# EAGLE design alien2 (EAGLE 5.10)
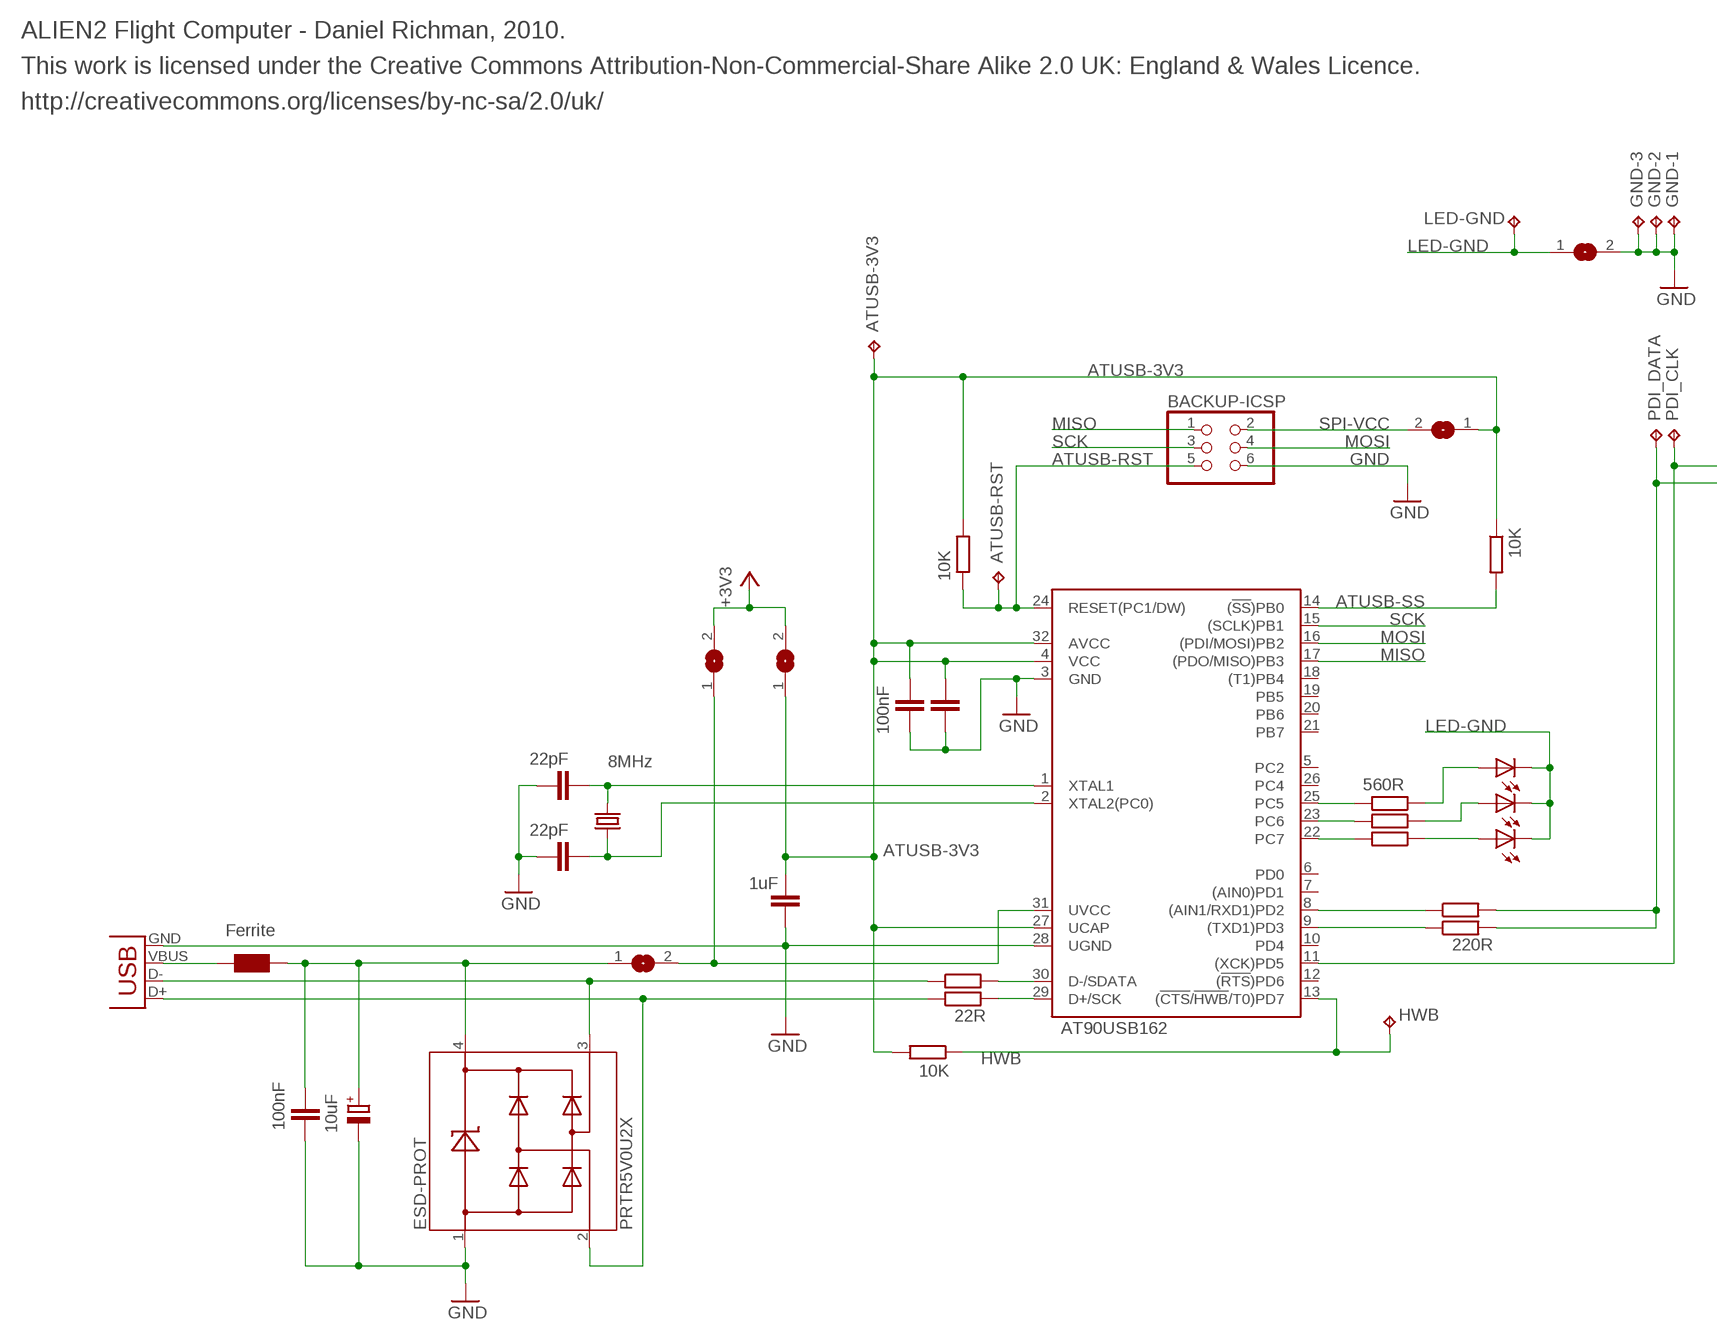
[diagram p0: schematic, sheet 1, part 1 of 2]
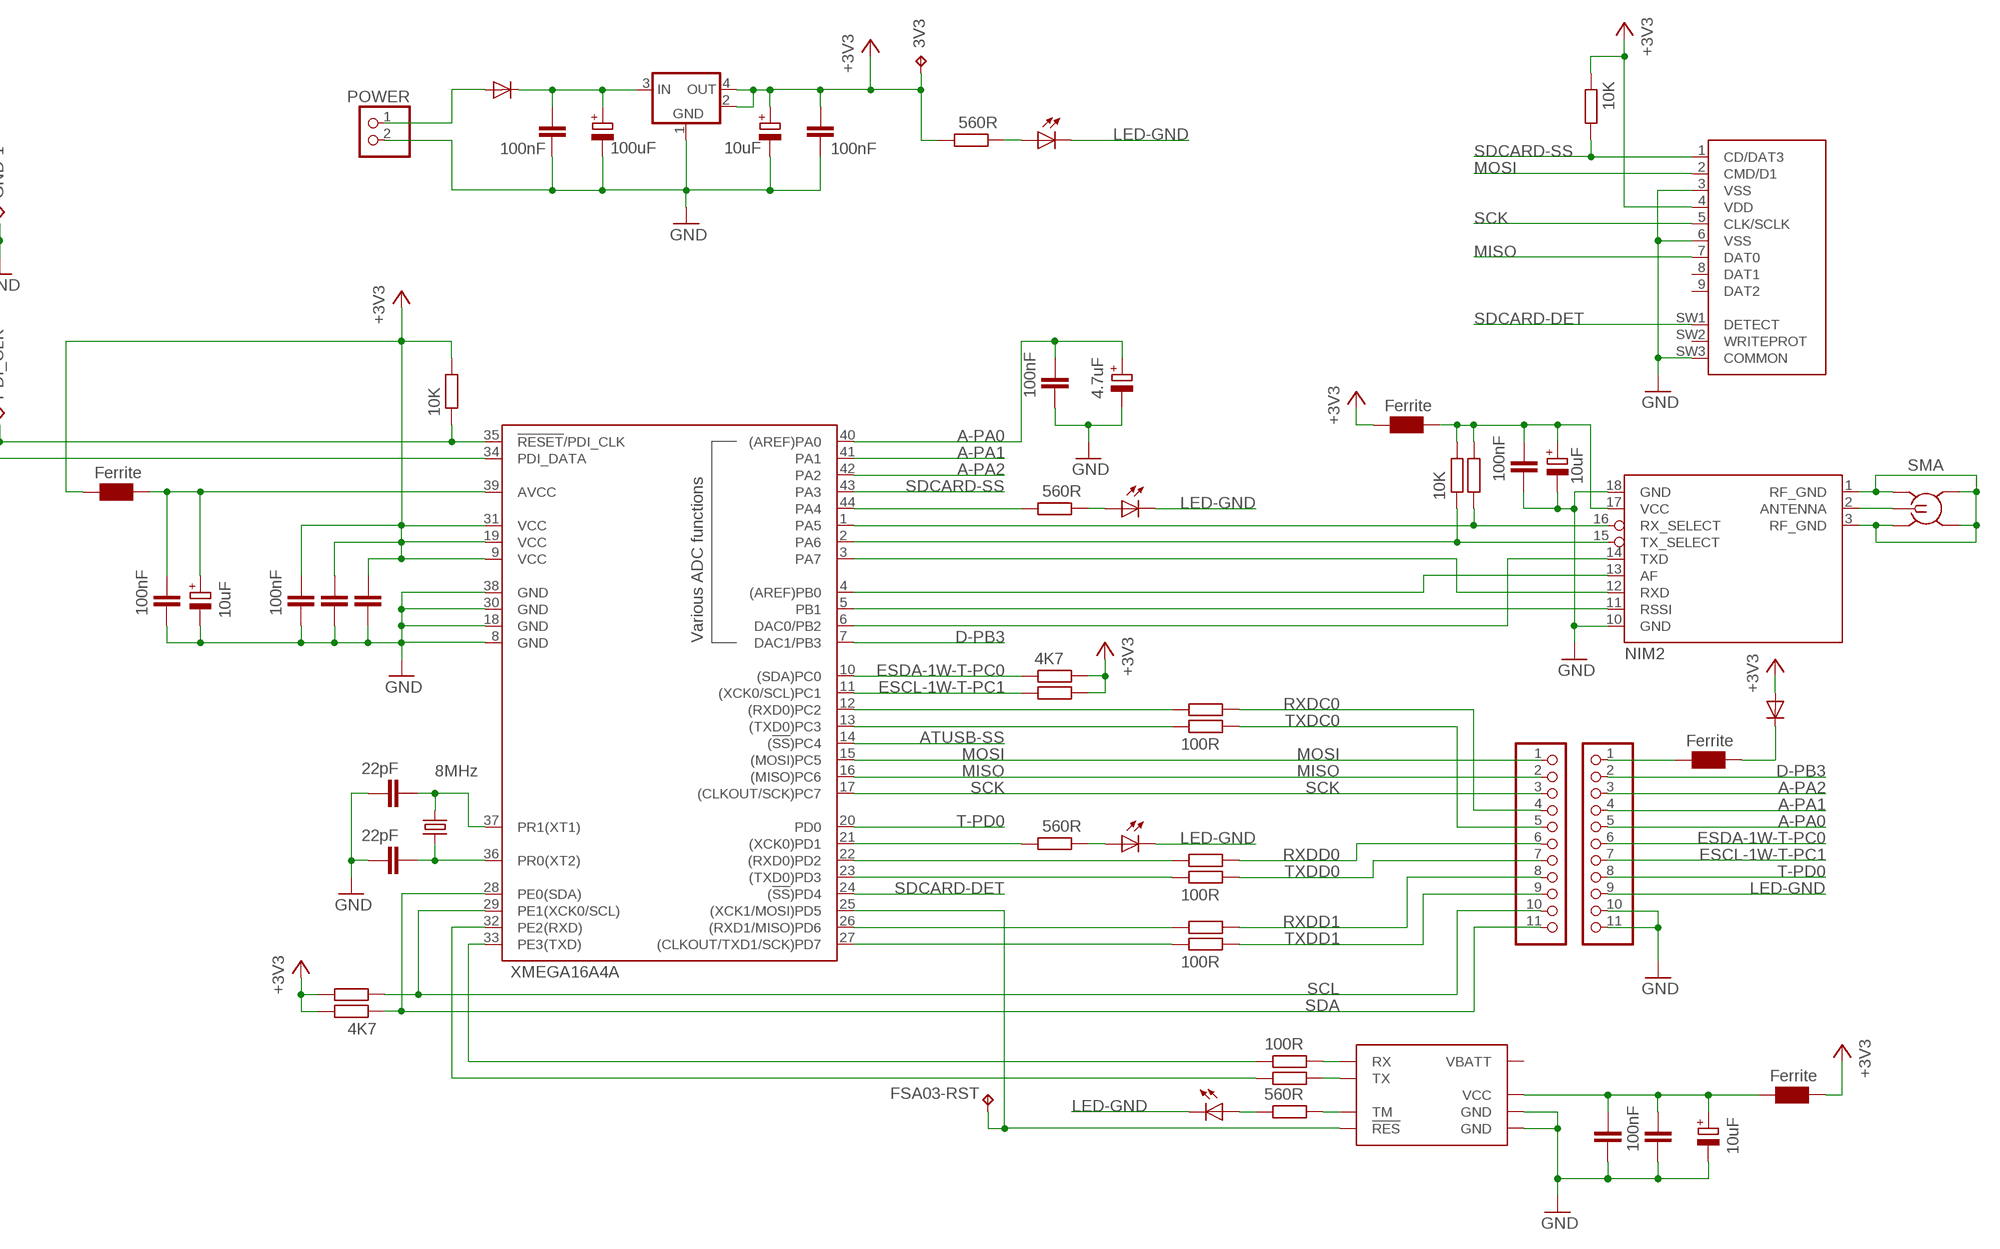
[diagram p1: schematic, sheet 1, part 2 of 2]

## Parts
3V3  TPTP10R  [TP10R]
ATUSB-3V3  TPTP10R  [TP10R]
ATUSB-RST  TPTP10R  [TP10R]
BACKUP-ICSP  PINHD-2X3  [ISP6]
BREAKOUT-1  PINHD-1X11  [1X11]
BREAKOUT-2  PINHD-1X11  [1X11]
BSPI-POWER  SJ  [SJ]
C1-UCAP  1uF  C-EUC0603  [C0603]
C2  22pF  C-EUC0603  [C0603]
C3  22pF  C-EUC0603  [C0603]
C4  22pF  C-EUC0603  [C0603]
C5  22pF  C-EUC0603  [C0603]
C10-FSA03-1  100nF  C-EUC0603  [C0603]
C10-FSA03-2  100nF  C-EUC0603  [C0603]
C10-NIM2  100nF  C-EUC0603  [C0603]
C10-VBUS  100nF  C-EUC0603  [C0603]
C10-XM  100nF  C-EUC0603  [C0603]
C10-XM-AVCC  100nF  C-EUC0603  [C0603]
C11-XM  100nF  C-EUC0603  [C0603]
C12-XM  100nF  C-EUC0603  [C0603]
C20-AREF  4.7uF  CPOL-EU153CLV-0405  [153CLV-0405]
C20-REGOUT  10uF  CPOL-EU153CLV-0405  [153CLV-0405]
C21-ATUSB  100nF  C-EUC0603  [C0603]
C21-VIN  100nF  C-EUC0603  [C0603]
C22-AREF  100nF  C-EUC0603  [C0603]
C22-REGOUT  100nF  C-EUC0603  [C0603]
C39-FSA03  10uF  CPOL-EU153CLV-0405  [153CLV-0405]
C39-NIM2  10uF  CPOL-EU153CLV-0405  [153CLV-0405]
C39-VBUS  10uF  CPOL-EU153CLV-0405  [153CLV-0405]
C39-VIN  100uF  CPOL-EU153CLV-0405  [153CLV-0405]
C39-XM-AVCC  10uF  CPOL-EU153CLV-0405  [153CLV-0405]
C40-ATUSB  100nF  C-EUC0603  [C0603]
D1  SHOTTKY  DIODE  [SMB]
D2  SHOTTKY  DIODE  [SMB]
ENABLE-VBUS  SJ  [SJ]
ESD-PROT  PRTR5V0U2X  [SOT143]
FB-BREAKOUT  Ferrite  WE-CBF_0603  [0603]
FB-FSA03  Ferrite  WE-CBF_0603  [0603]
FB-NIM2  Ferrite  WE-CBF_0603  [0603]
FB-USB  Ferrite  WE-CBF_0603  [0603]
FB-XM-AVCC  Ferrite  WE-CBF_0603  [0603]
FSA03  FSA03NOANT  [FSA03-NOANT]
FSA03-RST  TPTP10R  [TP10R]
GND-1  TPTP10R  [TP10R]
GND-2  TPTP10R  [TP10R]
GND-3  TPTP10R  [TP10R]
HWB  TPTP10R  [TP10R]
IC1  XMEGA16A4A  [TQFP44]
IC3  TC2117-3.3V  [SOT223]
LED1  LEDCHIP-LED0805  [CHIP-LED0805]
LED2  LEDCHIP-LED0805  [CHIP-LED0805]
LED3  LEDCHIP-LED0805  [CHIP-LED0805]
LED4  LEDCHIP-LED0805  [CHIP-LED0805]
LED5  LEDCHIP-LED0805  [CHIP-LED0805]
LED6  LEDCHIP-LED0805  [CHIP-LED0805]
LED7  LEDCHIP-LED0805  [CHIP-LED0805]
LED-GND  TPTP10R  [TP10R]
PDI_CLK  TPTP10R  [TP10R]
PDI_DATA  TPTP10R  [TP10R]
POWER  Farnell 1386722  PINHD-1X2  [1X02]
Q1-ATUSB  8MHz  CRYSTALHC49UP  [HC49UP]
Q2-XM  8MHz  CRYSTALHC49UP  [HC49UP]
R1-HWB  10K  R-EU_R0603  [R0603]
R2-ATUSB-RST  10K  R-EU_R0603  [R0603]
R3-USB  22R  R-EU_R0603  [R0603]
R4-USB  22R  R-EU_R0603  [R0603]
R5-PDI  220R  R-EU_R0603  [R0603]
R6-PDI  220R  R-EU_R0603  [R0603]
R7-XM-RST  10K  R-EU_R0603  [R0603]
R8  560R  R-EU_R0603  [R0603]
R9  10K  R-EU_R0603  [R0603]
R10-ATUSB-LED  560R  R-EU_R0603  [R0603]
R11  10K  R-EU_R0603  [R0603]
R12  560R  R-EU_R0603  [R0603]
R13  100R  R-EU_R0603  [R0603]
R14  100R  R-EU_R0603  [R0603]
R15-SDA  4K7  R-EU_R0603  [R0603]
R16-SCL  4K7  R-EU_R0603  [R0603]
R17-ESCL  4K7  R-EU_R0603  [R0603]
R18-ESDA  4K7  R-EU_R0603  [R0603]
R19-ATUSB-LED  560R  R-EU_R0603  [R0603]
R20-ATUSB-LED  560R  R-EU_R0603  [R0603]
R21  560R  R-EU_R0603  [R0603]
R22  100R  R-EU_R0603  [R0603]
R23  100R  R-EU_R0603  [R0603]
R24  100R  R-EU_R0603  [R0603]
R25  100R  R-EU_R0603  [R0603]
R26  100R  R-EU_R0603  [R0603]
R27  100R  R-EU_R0603  [R0603]
R28-SDCARD-SS  10K  R-EU_R0603  [R0603]
R29-ATUSB-SS  10K  R-EU_R0603  [R0603]
R30  560R  R-EU_R0603  [R0603]
SJ2  SJ  [SJ]
U$1  AT90USB162  [VQFP32]
U$2  NIM2  [NIM2]
UCAP-3V3  SJ  [SJ]
UVCC-3V3  SJ  [SJ]
X1  USBSMD  [USB-MINIB]
X2  SMA  [SMA-V]
X3  SD-CARD-HOLDER  SDBMF9186174  [SDBMF-009XXBXX2]

## Nets
+3V3: 3V3.TP C10-XM.1 C11-XM.1 C12-XM.1 C20-REGOUT.+ C22-REGOUT.1 D2.A FB-FSA03.1 FB-NIM2.2 FB-XM-AVCC.2 IC1.9(VCC) IC1.19(VCC) IC1.31(VCC) IC3.2(OUT) IC3.4(OUT) R7-XM-RST.2 R15-SDA.2 R16-SCL.2 R17-ESCL.2 R18-ESDA.2 R28-SDCARD-SS.1 R30.2 UCAP-3V3.2 UVCC-3V3.2 X3.4(VDD)
A-PA0: BREAKOUT-2.5 C20-AREF.+ C22-AREF.1 IC1.40((AREF)PA0)
A-PA1: BREAKOUT-2.4 IC1.41(PA1)
A-PA2: BREAKOUT-2.3 IC1.42(PA2)
ATUSB-3V3: ATUSB-3V3.TP BSPI-POWER.1 C1-UCAP.1 C21-ATUSB.1 C40-ATUSB.1 R1-HWB.2 R2-ATUSB-RST.2 R29-ATUSB-SS.1 U$1.4(VCC) U$1.27(UCAP) U$1.32(AVCC) UCAP-3V3.1
ATUSB-RST: ATUSB-RST.TP BACKUP-ICSP.5 R2-ATUSB-RST.1 U$1.24(RESET(PC1/DW))
ATUSB-SS: IC1.14((!SS!)PC4) R29-ATUSB-SS.2 U$1.14((!SS!)PB0)
D-PB3: BREAKOUT-2.2 IC1.7(DAC1/PB3)
ESCL-1W-T-PC1: BREAKOUT-2.7 IC1.11((XCK0/SCL)PC1) R17-ESCL.1
ESDA-1W-T-PC0: BREAKOUT-2.6 IC1.10((SDA)PC0) R18-ESDA.1
FSA03-RST: FSA03-RST.TP FSA03.RES(!RES!) IC1.25((XCK1/MOSI)PD5)
GND: BACKUP-ICSP.6 BREAKOUT-2.10 BREAKOUT-2.11 C1-UCAP.2 C2.2 C3.2 C4.2 C5.2 C10-FSA03-1.2 C10-FSA03-2.2 C10-NIM2.2 C10-VBUS.2 C10-XM-AVCC.2 C10-XM.2 C11-XM.2 C12-XM.2 C20-AREF.- C20-REGOUT.- C21-ATUSB.2 C21-VIN.2 C22-AREF.2 C22-REGOUT.2 C39-FSA03.- C39-NIM2.- C39-VBUS.- C39-VIN.- C39-XM-AVCC.- C40-ATUSB.2 ESD-PROT.1 FSA03.GND1(GND) FSA03.GND2(GND) GND-1.TP GND-2.TP GND-3.TP IC1.8(GND) IC1.18(GND) IC1.30(GND) IC1.38(GND) IC3.1(GND) POWER.2 SJ2.2 U$1.3(GND) U$1.28(UGND) U$2.10(GND) U$2.18(GND) X1.GND X3.3(VSS) X3.6(VSS) X3.SW3(COMMON)
HWB: HWB.TP R1-HWB.1 U$1.13((!CTS!/!HWB!/T0)PD7)
LED-GND: BREAKOUT-2.9 LED1.C LED2.C LED3.C LED4.C LED5.C LED6.C LED7.C LED-GND.TP SJ2.1
MISO: BACKUP-ICSP.1 BREAKOUT-1.2 IC1.16((MISO)PC6) U$1.17((PDO/MISO)PB3) X3.7(DAT0)
MOSI: BACKUP-ICSP.4 BREAKOUT-1.1 IC1.15((MOSI)PC5) U$1.16((PDI/MOSI)PB2) X3.2(CMD/D1)
N$1: R10-ATUSB-LED.2 U$1.22(PC7)
N$2: C10-VBUS.1 C39-VBUS.+ ENABLE-VBUS.1 ESD-PROT.4 FB-USB.1
N$3: R3-USB.2 U$1.30(D-/SDATA)
N$4: R4-USB.2 U$1.29(D+/SCK)
N$5: C3.1 Q1-ATUSB.2 U$1.1(XTAL1)
N$6: C2.1 Q1-ATUSB.1 U$1.2(XTAL2(PC0))
N$7: C21-VIN.1 C39-VIN.+ D1.C IC3.3(IN)
N$8: U$2.2(ANTENNA) X2.1(CENTRE)
N$9: ESD-PROT.3 R3-USB.1 X1.D-
N$10: ESD-PROT.2 R4-USB.1 X1.D+
N$11: LED1.A R10-ATUSB-LED.1
N$12: IC1.34(PDI_DATA) PDI_DATA.TP R5-PDI.2 R6-PDI.2
N$13: R5-PDI.1 U$1.8((AIN1/RXD1)PD2)
N$14: R6-PDI.1 U$1.9((TXD1)PD3)
N$17: C5.1 IC1.37(PR1(XT1)) Q2-XM.2
N$18: C4.1 IC1.36(PR0(XT2)) Q2-XM.1
N$19: LED4.A R8.1
N$20: IC1.3(PA7) U$2.12(RXD)
N$21: BREAKOUT-2.1 FB-BREAKOUT.2
N$22: IC1.32(PE2(RXD)) R14.1
N$23: IC1.33(PE3(TXD)) R13.1
N$24: IC1.1(PA5) R11.1 U$2.16(RX_SELECT)
N$25: IC1.2(PA6) R9.1 U$2.15(TX_SELECT)
N$26: IC1.6(DAC0/PB2) U$2.14(TXD)
N$27: IC1.4((AREF)PB0) U$2.13(AF)
N$28: IC1.5(PB1) U$2.11(RSSI)
N$29: FSA03.RX R13.2
N$30: LED2.A R12.1
N$31: IC1.35(!RESET!/PDI_CLK) PDI_CLK.TP R7-XM-RST.1 U$1.11((XCK)PD5)
N$32: FSA03.TM R12.2
N$33: LED6.A R21.1
N$34: D2.C FB-BREAKOUT.1
N$35: IC1.44(PA4) R8.2
N$36: FSA03.TX R14.2
N$37: R19-ATUSB-LED.2 U$1.23(PC6)
N$38: LED3.A R19-ATUSB-LED.1
N$39: R20-ATUSB-LED.2 U$1.25(PC5)
N$40: LED5.A R20-ATUSB-LED.1
N$41: IC1.21((XCK0)PD1) R21.2
N$42: IC1.12((RXD0)PC2) R22.1
N$43: IC1.13((TXD0)PC3) R23.1
N$44: IC1.22((RXD0)PD2) R24.1
N$45: IC1.23((TXD0)PD3) R25.1
N$46: IC1.26((RXD1/MISO)PD6) R26.1
N$47: IC1.27((CLKOUT/TXD1/SCK)PD7) R27.1
N$48: FB-USB.2 X1.VBUS
N$49: C10-NIM2.1 C39-NIM2.+ FB-NIM2.1 R9.2 R11.2 U$2.17(VCC)
N$50: C10-FSA03-1.1 C10-FSA03-2.1 C39-FSA03.+ FB-FSA03.2 FSA03.VCC
N$51: C10-XM-AVCC.1 C39-XM-AVCC.+ FB-XM-AVCC.1 IC1.39(AVCC)
N$52: LED7.A R30.1
N$53: D1.A POWER.1
N$56: ENABLE-VBUS.2 U$1.31(UVCC) UVCC-3V3.1
RF_GND: U$2.1(RF_GND) U$2.3(RF_GND) X2.2(GND1) X2.3(GND2) X2.4(GND3) X2.5(GND4)
RXDC0: BREAKOUT-1.4 R22.2
RXDD0: BREAKOUT-1.6 R24.2
RXDD1: BREAKOUT-1.8 R26.2
SCK: BACKUP-ICSP.3 BREAKOUT-1.3 IC1.17((CLKOUT/SCK)PC7) U$1.15((SCLK)PB1) X3.5(CLK/SCLK)
SCL: BREAKOUT-1.10 IC1.29(PE1(XCK0/SCL)) R16-SCL.1
SDA: BREAKOUT-1.11 IC1.28(PE0(SDA)) R15-SDA.1
SDCARD-DET: IC1.24((!SS!)PD4) X3.SW1(DETECT)
SDCARD-SS: IC1.43(PA3) R28-SDCARD-SS.2 X3.1(CD/DAT3)
SPI-VCC: BACKUP-ICSP.2 BSPI-POWER.2
T-PD0: BREAKOUT-2.8 IC1.20(PD0)
TXDC0: BREAKOUT-1.5 R23.2
TXDD0: BREAKOUT-1.7 R25.2
TXDD1: BREAKOUT-1.9 R27.2
Unconnected: FSA03.NC1(NC) FSA03.NC2(NC) FSA03.NC3(NC) FSA03.NC4(NC) FSA03.NC5(NC) U$1.5(PC2) U$1.6(PD0) U$1.7((AIN0)PD1) U$1.10(PD4) U$1.12((!RTS!)PD6) U$1.18((T1)PB4) U$1.19(PB5) U$1.20(PB6) U$1.21(PB7) U$1.26(PC4) X3.8(DAT1) X3.9(DAT2) X3.SW2(WRITEPROT)

## Notes on the sheet
- ALIEN2 Flight Computer - Daniel Richman, 2010.
- This work is licensed under the Creative Commons Attribution-Non-Commercial-Share Alike 2.0 UK: England & Wales Licence.
- http://creativecommons.org/licenses/by-nc-sa/2.0/uk/

## Power pins joined to a net without a drawn wire
VBATT: FSA03.VBATT

## Library data of the parts
3V3 ATUSB-3V3 ATUSB-RST FSA03-RST GND-1-GND-3 HWB LED-GND PDI_CLK PDI_DATA = testpad:TP: Test pad
BACKUP-ICSP = daniel-misc:PINHD-2X3: PIN HEADER
BREAKOUT-1 BREAKOUT-2 = pinhead:PINHD-1X11: PIN HEADER
BSPI-POWER ENABLE-VBUS SJ2 UCAP-3V3 UVCC-3V3 = jumper:SJ: SMD solder JUMPER
C1-UCAP C2-C5 C10-FSA03-1 C10-FSA03-2 C10-NIM2 C10-VBUS C10-XM C10-XM-AVCC C11-XM C12-XM C21-ATUSB C21-VIN C22-AREF C22-REGOUT C40-ATUSB = resistor:C-EU: CAPACITOR, European symbol
C20-AREF C20-REGOUT C39-FSA03 C39-NIM2 C39-VBUS C39-VIN C39-XM-AVCC = resistor:CPOL-EU: POLARIZED CAPACITOR, European symbol
D1 D2 = daniel-misc:DIODE
ESD-PROT = daniel-misc:PRTR5V0U2X
FB-BREAKOUT FB-FSA03 FB-NIM2 FB-USB FB-XM-AVCC = wuerth-elektronik:WE-CBF: SMD EMI Suppression Ferrite Beads - excellent anti-EMI properties - low DCR - impedances till 3000 ohms - rated current up to 6 A
FSA03 = FSA03:FSA03: Falcom FSA03 surface mount GPS with ublox chipset, part created by Landon Cox, ESawdust.com
IC1 = avr2:XMEGA16A4: MICROCONTROLLER Features High-performance, Low-power 8/16-bit AVR XMEGA Microcontroller Non-Volatile Program and Data Memories - 16 KB - 128 KB of In-System Self-Programmable Flash - 4 KB - 8 KB Boot Code Section with Independent Lock Bits - 1 KB - 2 KB EEPROM - 2 KB - 8 KB Internal SRAM Peripheral Features - Four-channel DMA Controller with support for external requests - Eight-channel Event System - Five 16-bit Timer/Counters Three Timer/Counters with 4 Output Compare or Input Capture channels Two Timer/Counters with 2 Output Compare or Input Capture channels High-Resolution Extensions on all Timer/Counters Advanced Waveform Extension on one Timer/Counter - Five USARTs IrDA Extension on one USART - Two Two-Wire Interfaces with dual address match (I2C and SMBus compatible) - Two SPIs (Serial Peripheral Interfaces) peripherals - AES and DES Crypto Engine - 16-bit Real Time Counter with Separate Oscillator - One Twelve-channel, 12-bit, 2 Msps Analog to Digital Converter - One Two-channel, 12-bit, 1 Msps Digital to Analog Converter - Two Analog Comparators with Window compare function - External Interrupts on all General Purpose I/O pins - Programmable Watchdog Timer with Separate On-chip Ultra Low Power Oscillator Special Microcontroller Features - Power-on Reset and Programmable Brown-out Detection - Internal and External Clock Options with PLL - Programmable Multi-level Interrupt Controller - Sleep Modes: Idle, Power-down, Standby, Power-save, Extended Standby - Advanced Programming, Test and Debugging Interfaces PDI (Program and Debug Interface) for programming, test and debugging I/O and Packages - 34 Programmable I/O Lines - 44 - lead TQFP - 44 - pad VQFN/QFN - 49 - ball VFBGA Operating Voltage - 1.6 - 3.6V Speed performance - 0 - 12 MHz @ 1.6 - 3.6V - 0 - 32 MHz @ 2.7 - 3.6V Drawn by Dipl.-Ing. (FH) Robert Siegler Created: 27.05.09
IC3 = daniel-misc:TC2117-3.3V: MICROCHIP - TC2117-3.3VDBTR - CMSO LDO, 3.3V, 800MA, SOT223-3 Source: http://uk.farnell.com/microchip/tc2117-3-3vdbtr/cmso-ldo-3-3v-800ma-sot223-3/dp/1605581 Manufacturer: MICROCHIP Farnell Order Code: 1605581 Manufacturer Part No: TC2117-3.3VDBTR RoHS: Yes Description: CMSO LDO, 3.3V, 800MA, SOT223-3 Output Voltage: 3.3V Dropout voltage: 0.45V No. of Pins: 3 Voltage Regulator IC Case Style: SOT-223 Operating Temperature Range: -40°C to +125°C Case Style: SOT-223 Max Operating Temperature: 125°C Min Temperature Operating: -40°C Base Number: 2117 Max Input Voltage: 6V Max Output Current: 0.8A Max Output Voltage: 3.3V Max Supply Voltage: 6V Min Input Voltage: 2.7V Min Supply Voltage: 2.7V No. of Outputs: 1 Percentage Accuracy: 0.5% Termination Type: SMD Voltage Regulator Type: Fixed
LED1-LED7 = led:LED: LED OSRAM: - CHIPLED LG R971, LG N971, LY N971, LG Q971, LY Q971, LO R971, LY R971 LH N974, LH R974 LS Q976, LO Q976, LY Q976 LO Q996 - Hyper CHIPLED LW Q18S LB Q993, LB Q99A, LB R99A - SideLED LS A670, LO A670, LY A670, LG A670, LP A670 LB A673, LV A673, LT A673, LW A673 LH A674 LY A675 LS A676, LA A676, LO A676, LY A676, LW A676 LS A679, LY A679, LG A679 - Hyper Micro SIDELED® LS Y876, LA Y876, LO Y876, LY Y876 LT Y87S - SmartLED LW L88C, LW L88S LB L89C, LB L89S, LG L890 LS L89K, LO L89K, LY L89K LS L896, LA L896, LO L896, LY L896 - TOPLED LS T670, LO T670, LY T670, LG T670, LP T670 LSG T670, LSP T670, LSY T670, LOP T670, LYG T670 LG T671, LOG T671, LSG T671 LB T673, LV T673, LT T673, LW T673 LH T674 LS T676, LA T676, LO T676, LY T676, LB T676, LH T676, LSB T676, LW T676 LB T67C, LV T67C, LT T67C, LS T67K, LO T67K, LY T67K, LW E67C LS E67B, LA E67B, LO E67B, LY E67B, LB E67C, LV E67C, LT E67C LW T67C LS T679, LY T679, LG T679 LS T770, LO T770, LY T770, LG T770, LP T770 LB T773, LV T773, LT T773, LW T773 LH T774 LS E675, LA E675, LY E675, LS T675 LS T776, LA T776, LO T776, LY T776, LB T776 LHGB T686 LT T68C, LB T68C - Hyper Mini TOPLED® LB M676 - Mini TOPLED Santana® LG M470 LS M47K, LO M47K, LY M47K Source: http://www.osram.convergy.de LUXEON: - LUMILED® LXK2-PW12-R00, LXK2-PW12-S00, LXK2-PW14-U00, LXK2-PW14-V00 LXK2-PM12-R00, LXK2-PM12-S00, LXK2-PM14-U00 LXK2-PE12-Q00, LXK2-PE12-R00, LXK2-PE12-S00, LXK2-PE14-T00, LXK2-PE14-U00 LXK2-PB12-K00, LXK2-PB12-L00, LXK2-PB12-M00, LXK2-PB14-N00, LXK2-PB14-P00, LXK2-PB14-Q00 LXK2-PR12-L00, LXK2-PR12-M00, LXK2-PR14-Q00, LXK2-PR14-R00 LXK2-PD12-Q00, LXK2-PD12-R00, LXK2-PD12-S00 LXK2-PH12-R00, LXK2-PH12-S00 LXK2-PL12-P00, LXK2-PL12-Q00, LXK2-PL12-R00 Source: www.luxeon.com KINGBRIGHT: KA-3528ASYC Source: www.kingbright.com
POWER = pinhead:PINHD-1X2: PIN HEADER
Q1-ATUSB Q2-XM = crystal:CRYSTAL: CRYSTAL
R1-HWB R2-ATUSB-RST R3-USB R4-USB R5-PDI R6-PDI R7-XM-RST R8 R9 R10-ATUSB-LED R11-R14 R15-SDA R16-SCL R17-ESCL R18-ESDA R19-ATUSB-LED R20-ATUSB-LED R21-R27 R28-SDCARD-SS R29-ATUSB-SS R30 = resistor:R-EU_: RESISTOR, European symbol
U$1 = avr2:AT90USB162
U$2 = radiometrix:NIM2
X1 = SparkFun:USB: USB Connectors USB-B-PTH is fully proven SKU : PRT-00139 USB-miniB is fully proven SKU : PRT-00587 USB-A-PCB is untested. USB-A-H is throughly reviewed, but untested. Spark Fun Electronics SKU : PRT-00437 USB-B-SMT is throughly reviewed, but untested. Needs silkscreen touching up. USB-A-S has not been used/tested USB-MB-H has not been used/tested
X2 = daniel-misc:SMA: FEMALE SMA CONNECTOR Radiall distributor RS 112-3794
X3 = daniel-misc:SDBMF: SD MEMORY CARD PUSH-PUSH WITH CONNECTOR TYPE B (BIG SWUÌTCH #3) KINGFONT PRECISION INDUSTIAL CO., LTD Source: http://www.farnell.com/datasheets/74273.pdf Best.-Nr.: 9186174 Hersteller: MULTICOMP Herstellerbez.: SDBMF-00915B0T2

## Net classes
3 usbvcc: width 0.508 mm, drill 0.508 mm, clearance 0.152 mm

## Board
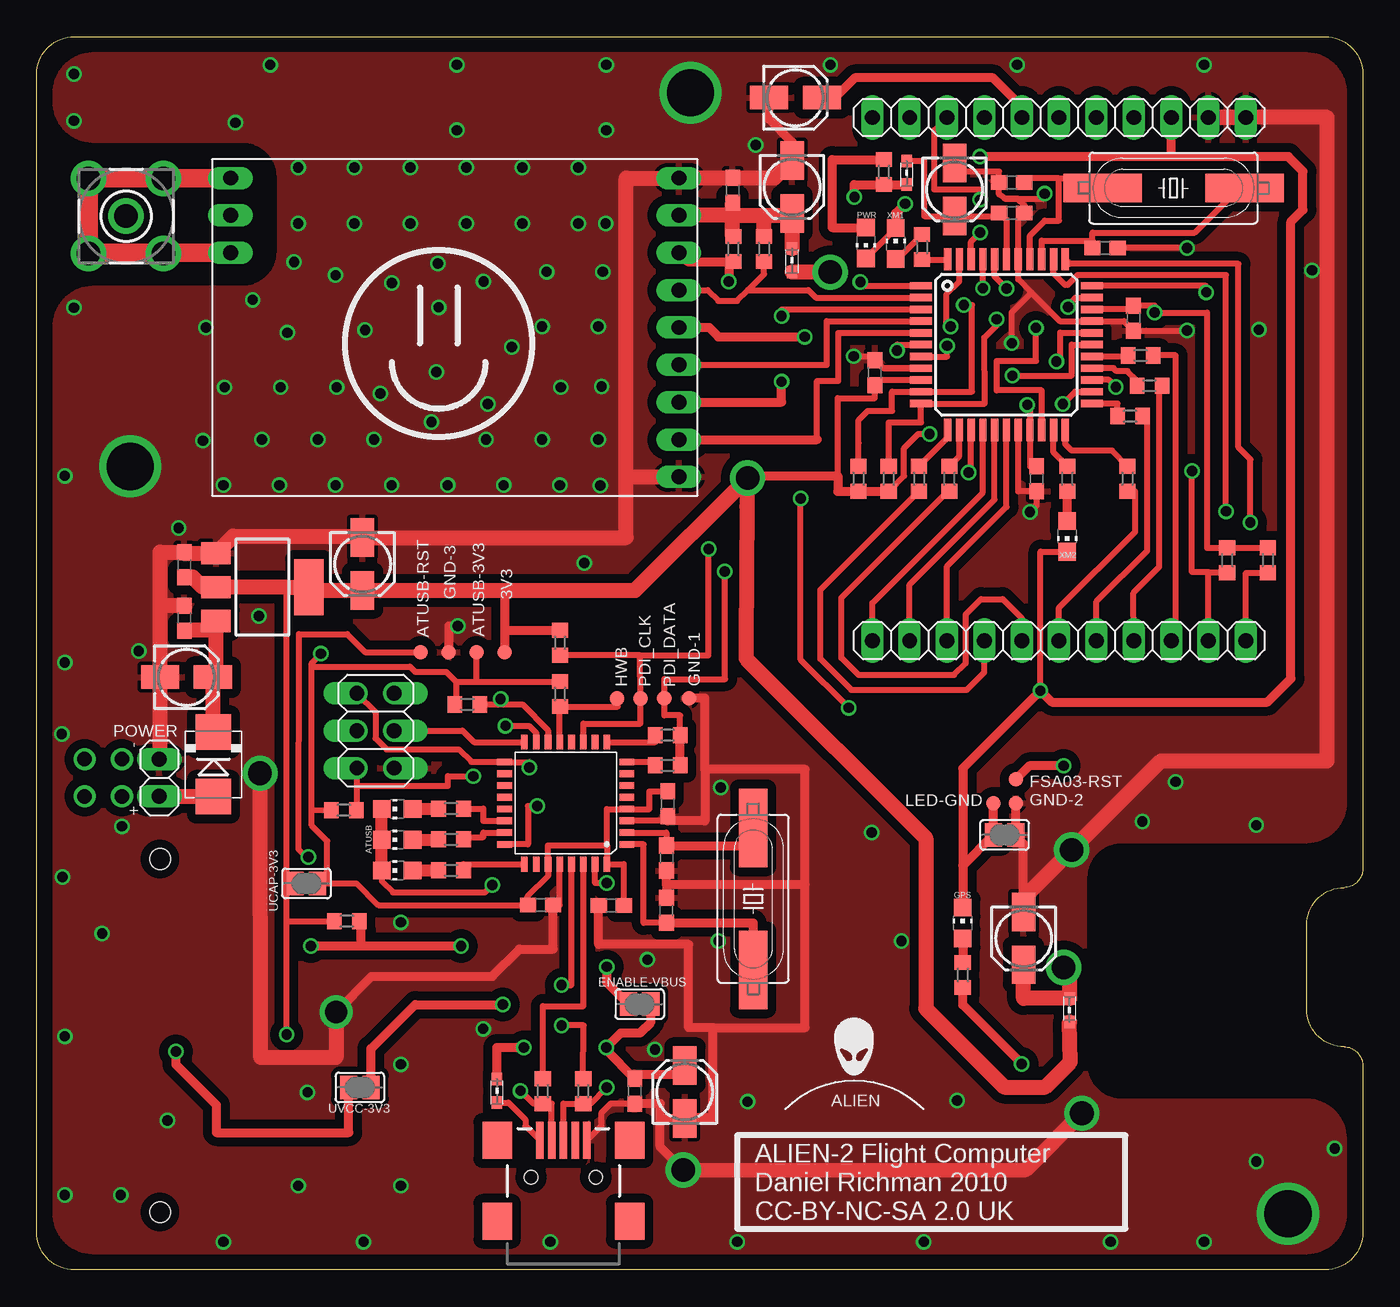
[diagram p2: board, top side]
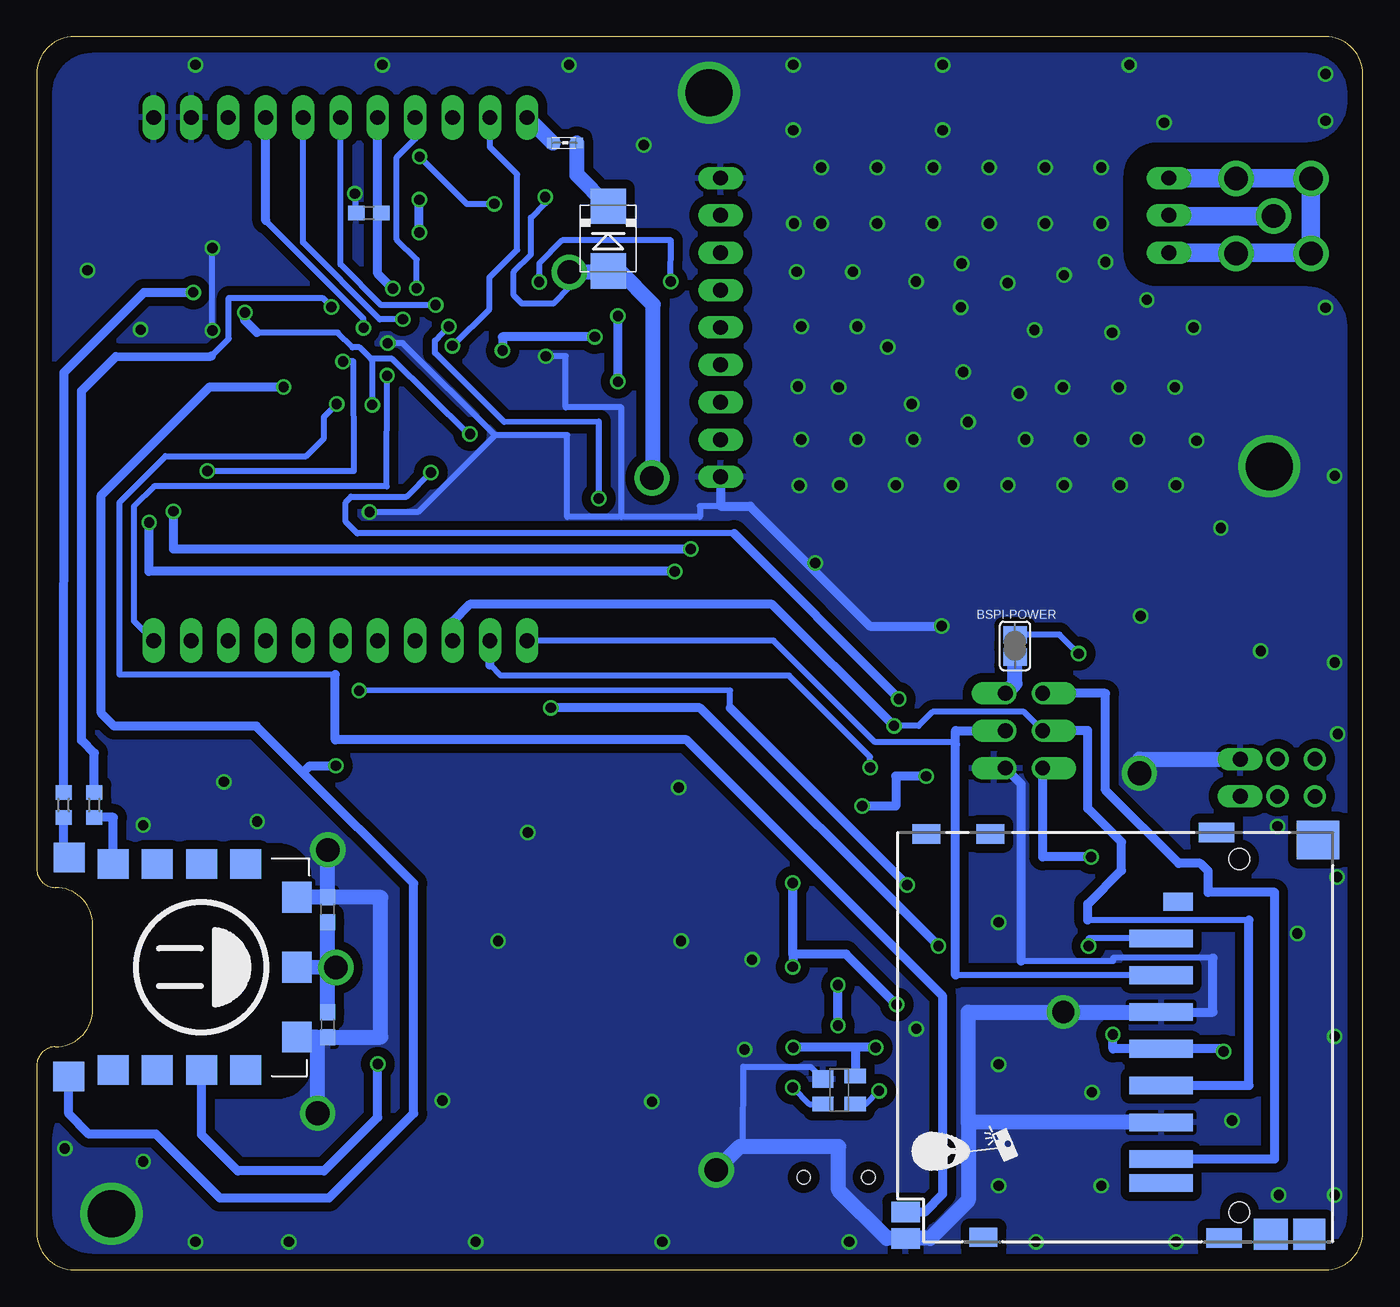
[diagram p3: board, bottom side, seen from below]

Size 90.17 x 83.82 mm. Coordinates in mm from the lower left corner, seen from the top.
Outline: 88.9,15.16 arc-90 86.36,17.7 86.36,23.44 arc-90 88.9,25.98 arc90 90.17,27.25 90.17,81.28 arc90 87.63,83.82 2.54,83.82 arc90 0,81.28 0,2.54 arc90 2.54,0 87.63,0 arc90 90.17,2.54 90.17,13.89 arc90 88.9,15.16
Copper layers (1*16): Top 0.035mm / dielectric 1.5mm / Bottom 0.035mm
Design rules "Fusion_eagle_rule_v1.1": minimum track width 6mil, minimum drill 12mil, track to track 6mil, track to pad 6mil, pad to pad 6mil, via to via 6mil, smd to smd 0mil, copper to edge 10mil, drill to drill 10mil, minimum pad ring 10mil, minimum via ring 6mil, stop-mask expansion 2mil, vias tented up to drill 100mil, thermal gap 10mil

### Footprints (pad centres in the part's own frame; a part is rotated, then mirrored left to right if it is on the bottom)
TP10R = smd 1 x 1: TP 0,0
ISP6 = drill 1.016 offset: 1 -2.54,-1.27; 2 -2.54,1.27; 3 0,-1.27; 4 0,1.27; 5 2.54,-1.27; 6 2.54,1.27
1X11 = drill 1.016 long: 1 -12.7,0; 2 -10.16,0; 3 -7.62,0; 4 -5.08,0; 5 -2.54,0; 6 0,0; 7 2.54,0; 8 5.08,0; 9 7.62,0; 10 10.16,0; 11 12.7,0
SJ = smd 1.168 x 1.6: 1 -0.762,0; 2 0.762,0
C0603 = smd 1.1 x 1: 1 -0.85,0; 2 0.85,0
153CLV-0405 = smd 2.6 x 1.6: + 1.8,0; - -1.8,0
SMB = smd 2.4 x 2.4: A 2.2,0; C -2.2,0
SOT143 = smd 1.2 x 1.44: 1 -0.75,-1.1 | smd 1 x 1.44: 2 0.95,-1.1; 3 0.95,1.1; 4 -0.95,1.1
0603 = smd 0.85 x 0.7: 1 -0.9,0; 2 0.7,0
FSA03-NOANT = smd 2.1 x 2: GND1 -4.75,-6.5; GND2 4.75,-6.5; VCC 0,-6.5 | smd 2 x 2.1: NC1 -7,6; NC2 -7,3; NC3 7,-3; NC4 7,0; NC5 7,3; RES -7.43,9.025; RX 7.454,9; TM -7,0; TX 7,6; VBATT -7,-3
TQFP44 = smd 1.5 x 0.5: 1 -5.8,4; 2 -5.8,3.2; 3 -5.8,2.4; 4 -5.8,1.6; 5 -5.8,0.8; 6 -5.8,0; 7 -5.8,-0.8; 8 -5.8,-1.6; 9 -5.8,-2.4; 10 -5.8,-3.2; 11 -5.8,-4; 23 5.8,-4; 24 5.8,-3.2; 25 5.8,-2.4; 26 5.8,-1.6; 27 5.8,-0.8; 28 5.8,0; 29 5.8,0.8; 30 5.8,1.6; 31 5.8,2.4; 32 5.8,3.2; 33 5.8,4 | smd 0.5 x 1.5: 12 -4,-5.8; 13 -3.2,-5.8; 14 -2.4,-5.8; 15 -1.6,-5.8; 16 -0.8,-5.8; 17 0,-5.8; 18 0.8,-5.8; 19 1.6,-5.8; 20 2.4,-5.8; 21 3.2,-5.8; 22 4,-5.8; 34 4,5.8; 35 3.2,5.8; 36 2.4,5.8; 37 1.6,5.8; 38 0.8,5.8; 39 0,5.8; 40 -0.8,5.8; 41 -1.6,5.8; 42 -2.4,5.8; 43 -3.2,5.8; 44 -4,5.8
SOT223 = smd 1.5 x 2: 1 -2.3,-3.15; 2 0,-3.15; 3 2.3,-3.15 | smd 3.8 x 2: 4 0,3.15
CHIP-LED0805 = smd 1.2 x 1.2: A 0,-1.05; C 0,1.05
1X02 = drill 1.016 long: 1 -1.27,0; 2 1.27,0
HC49UP = smd 5.334 x 1.93: 1 -4.826,0; 2 4.826,0
R0603 = smd 1 x 1.1: 1 -0.85,0; 2 0.85,0
VQFP32 = smd 1 x 0.45: 1 -4.15,2.8; 2 -4.15,2; 3 -4.15,1.2; 4 -4.15,0.4; 5 -4.15,-0.4; 6 -4.15,-1.2; 7 -4.15,-2; 8 -4.15,-2.8; 17 4.15,-2.8; 18 4.15,-2; 19 4.15,-1.2; 20 4.15,-0.4; 21 4.15,0.4; 22 4.15,1.2; 23 4.15,2; 24 4.15,2.8 | smd 0.45 x 1: 9 -2.8,-4.15; 10 -2,-4.15; 11 -1.2,-4.15; 12 -0.4,-4.15; 13 0.4,-4.15; 14 1.2,-4.15; 15 2,-4.15; 16 2.8,-4.15; 25 2.8,4.15; 26 2,4.15; 27 1.2,4.15; 28 0.4,4.15; 29 -0.4,4.15; 30 -1.2,4.15; 31 -2,4.15; 32 -2.8,4.15
NIM2 = drill 1.016 long: 1 -15.24,10.16; 2 -15.24,7.62; 3 -15.24,5.08; 10 15.24,-10.16; 11 15.24,-7.62; 12 15.24,-5.08; 13 15.24,-2.54; 14 15.24,0; 15 15.24,2.54; 16 15.24,5.08; 17 15.24,7.62; 18 15.24,10.16
USB-MINIB = smd 2.5 x 0.5: D+ 2.5,0; D- 2.5,0.8; GND 2.5,-1.6; ID 2.5,-0.8; VBUS 2.5,1.6 | smd 2.5 x 2: GND@1 -3,-4.5; GND@2 -3,4.5; GND@3 2.5,4.5; GND@4 2.5,-4.5 | hole 0.9: 0,2.2; 0,-2.2
SMA-V = drill 1.6 round: 1 0,0; 2 -2.55,2.55; 3 2.55,2.55; 4 2.55,-2.55; 5 -2.55,-2.55
SDBMF-009XXBXX2 = smd 1.2 x 4.3: 1 6.7,5.325; 2 4.2,5.325; 3 1.7,5.325; 4 -0.8,5.325; 5 -3.3,5.325; 6 -5.8,5.325; 7 -8.3,5.325; 8 -9.925,5.325 | smd 1.2 x 2: 9 9.2,4.175 | smd 2.1 x 2.286: M1 -13.4,-2.127 | smd 2.6 x 2.9: M2 13.4,-5.35 | smd 1.3 x 1.9: M3 -13.6,17.4; M4 13.8,16.95; M5 13.8,21.3 | smd 1.338 x 2.4: M6 -13.654,1.048; M7 13.905,1.556 | smd 1.4 x 1.95: SW1 -11.9,22.7; SW3 -13.7,22.7 | smd 2.1 x 2.2: SW2 -13.4,-4.75 | hole 1.4: -11.9,0; 12.1,0

### Placement (x,y rotation side)
3V3  31.83,41.99 0 top
ATUSB-3V3  29.92,41.99 0 top
ATUSB-RST  26.11,41.99 0 top
BACKUP-ICSP  23.04,36.65 270 top
BREAKOUT-1  69.52,42.77 0 top
BREAKOUT-2  69.52,78.33 0 top
BSPI-POWER  23.65,42.42 270 bottom
C1-UCAP  34.26,24.79 0 top
C2  42.82,27.99 270 top
C3  42.82,24.43 90 top
C4  72.64,69.47 0 top
C5  66.29,73.91 180 top
C10-FSA03-1  70.38,24.49 90 bottom
C10-FSA03-2  70.38,16.66 270 bottom
C10-NIM2  47.32,73.38 90 top
C10-VBUS  40.67,12.14 270 top
C10-XM  74.57,64.69 270 top
C10-XM-AVCC  66.29,71.83 0 top
C11-XM  57,60.99 90 top
C12-XM  68,53.77 270 top
C20-AREF  51.59,79.68 0 top
C20-REGOUT  22.15,47.98 270 top
C21-ATUSB  39.07,24.77 180 top
C21-VIN  10.03,44.3 90 top
C22-AREF  67.59,71.83 180 bottom
C22-REGOUT  10.03,47.93 90 top
C39-FSA03  67.11,22.53 270 top
C39-NIM2  51.36,73.61 270 top
C39-VBUS  44.07,12.09 90 top
C39-VIN  10.19,40.28 0 top
C39-XM-AVCC  62.41,73.43 270 top
C40-ATUSB  42.9,31.67 270 top
D1  12.01,34.37 270 top
D2  51.31,70.1 270 bottom
ENABLE-VBUS  41,18.06 180 top
ESD-PROT  35.61,12.22 270 bottom
FB-BREAKOUT  54.33,76.61 180 bottom
FB-FSA03  70.23,17.75 90 top
FB-NIM2  51.36,68.53 270 top
FB-USB  31.29,12.06 270 top
FB-XM-AVCC  59.16,74.47 270 top
FSA03  78.97,20.57 90 bottom
FSA03-RST  66.57,33.35 0 top
GND-1  44.35,38.86 0 top
GND-2  66.57,31.72 0 top
GND-3  28.02,41.99 0 top
HWB  39.47,38.84 0 top
IC1  65.94,62.89 0 top
IC3  15.34,46.41 270 top
LED1  24.51,31.32 90 top
LED2  62.97,23.57 0 top
LED3  24.51,29.24 90 top
LED4  58.42,69.77 0 top
LED5  24.51,27.15 90 top
LED6  70.08,49.86 180 top
LED7  56.39,69.8 180 top
LED-GND  65.05,31.72 0 top
PDI_CLK  41.05,38.84 0 top
PDI_DATA  42.67,38.86 0 top
POWER  8.33,33.45 90 top
Q1-ATUSB  48.72,25.22 270 top
Q2-XM  77.29,73.53 180 top
R1-HWB  35.59,39.14 90 top
R2-ATUSB-RST  20.88,31.24 180 top
R3-USB  34.42,12.14 90 top
R4-USB  37.16,12.14 90 top
R5-PDI  42.9,34.29 0 top
R6-PDI  42.9,36.35 0 top
R7-XM-RST  35.59,42.62 90 top
R8  60.2,69.52 270 top
R9  49.45,69.39 90 top
R10-ATUSB-LED  28.17,31.34 0 top
R11  47.37,69.39 90 top
R12  62.97,20.04 270 top
R13  88.34,31.6 270 bottom
R14  86.26,31.6 270 bottom
R15-SDA  83.72,48.23 90 top
R16-SCL  80.95,48.23 90 top
R17-ESCL  57.94,53.77 270 top
R18-ESDA  55.88,53.77 270 top
R19-ATUSB-LED  28.17,29.26 0 top
R20-ATUSB-LED  28.17,27.15 0 top
R21  70.08,53.77 90 top
R22  59.99,53.77 270 top
R23  62.05,53.77 270 top
R24  74.17,53.77 270 top
R25  74.35,58.04 0 top
R26  75.67,60.1 0 top
R27  75.06,62.15 0 top
R28-SDCARD-SS  21.08,23.7 0 top
R29-ATUSB-SS  29.29,38.43 0 top
R30  57.61,74.63 270 top
SJ2  65.81,29.57 0 top
U$1  35.97,31.72 180 top
U$2  28.42,64.06 0 top
U$3  [SMILEY-D]  78.99,20.57 90 bottom
U$4  [SMILEY]  27.33,62.97 0 top
U$5  [ALIEN]  26.82,8.08 90 bottom
U$6  [ALIEN2]  55.6,13.31 0 top
UCAP-3V3  18.34,26.26 180 top
UVCC-3V3  21.97,12.4 180 top
X1  35.81,6.3 90 top
X2  6.07,71.63 180 top
X3  8.38,15.82 90 bottom

### Tracks (layer width: path | path; a pad name or v marks a point on that pad's centre or on a via)
+3V3  (via drill 0.7, 1.6)
  Top 0.406: IC1.31 74.32,65.29 C10-XM.1 76.02,65.54 v76.02,65.08 79.58,65.08 79.58,49.07 80.67,49.07 | IC1.9 57.35,60.49 C11-XM.1 57,59.26 54.48,59.26 54.48,53.98 | FB-XM-AVCC.2 | v16.99,16 16.99,23.7 | C12-XM.1 67.54,54.62 IC1.19 67.54,58.62 v67.36,58.8 | R16-SCL.2 80.7,49.09 80.67,49.07 | 83.41,49.09 R15-SDA.2 83.69,49.07 80.67,49.07 | v48.34,53.82 48.34,53.98 | 16.99,23.7 R28-SDCARD-SS.1 | 16.99,26.26 16.99,46.41 | v60.71,56.82 59.94,56.82 58.98,55.85 58.98,53.96 R17-ESCL.2 | 16.99,26.26 UCAP-3V3.2 | 16.99,23.7 16.99,26.26
  Top 0.61: FB-XM-AVCC.2 R30.2 55.6,73.78 v55.6,72.92 | R17-ESCL.2 R18-ESDA.2 54.48,52.92 54.48,53.98 48.34,53.98 | 31.83,43.47 3V3.TP | 31.83,43.47 R7-XM-RST.2 | 31.83,46.18 31.83,43.47 | UVCC-3V3.2 21.21,9.32 12.22,9.32 12.22,11.2 9.47,13.95 v9.47,14.83
  Top 1.016: C22-REGOUT.1 10.6,47.08 11.28,46.41 IC3.2 16.99,46.41 IC3.4 18.64,46.41 18.82,46.58 18.82,46.18 C20-REGOUT.+ 31.83,46.18 40.69,46.18 v48.34,53.82 48.29,53.77 48.29,51.89 48.24,42.7 48.24,41.55 60.45,29.34 60.45,17.75 65.79,12.42 68.58,12.42 70.28,14.12 FB-FSA03.1 | v53.95,67.82 53.94,67.83 FB-NIM2.2
  Bottom 0.406: 67.36,61.92 v67.36,58.8 | v60.71,56.82 60.83,56.82 65.99,61.92 67.36,61.92 | 75.18,63.7 69.7,63.7 68.71,62.71 68.22,62.71 67.44,61.92 67.36,61.92 | v55.6,72.92 55.6,72.49 56.57,71.53 56.57,69.01 57.73,67.84 57.73,66.24 57.17,65.68 55.04,65.68 53.95,66.78 v53.95,67.82
  Bottom 0.61: v16.99,16 16.99,15.02 X3.4 9.47,15.02 v9.47,14.83 | 75.18,63.7 76.02,64.54 v76.02,65.08
  Bottom 1.016: v48.34,53.82 48.26,53.82 48.26,65.61 50.56,67.9 D2.A 51.39,67.82 v53.95,67.82
A-PA0  (via drill 0.7)
  Top 0.406: v65.96,66.7 65.14,67.53 IC1.40
  Top 0.61: C20-AREF.+ 54.28,79.68 55.63,81.03 65.02,81.03 66.98,79.07 BREAKOUT-2.5
  Bottom 0.406: C22-AREF.1 66.98,71.83 66.98,71.86
  Bottom 0.61: BREAKOUT-2.5 66.98,71.86 66.98,67.72 v65.96,66.7
A-PA1  (via drill 0.7)
  Top 0.406: v64.34,66.73 IC1.41 | IC1.41
  Bottom 0.406: v64.34,66.73 64.34,66.8 IC1.41 65.68,70.04 65.68,75.64 64.44,76.89 BREAKOUT-2.4
A-PA2  (via drill 0.7)
  Top 0.406: 63.79,70.14 63.54,69.89 IC1.42 | 63.79,70.14 v64.16,70.51 64.16,70.5 63.79,70.14 | BREAKOUT-2.3 61.04,77.47 61.04,73.43 64.16,73.43 v64.16,72.75
  Bottom 0.61: v64.16,70.51 v64.16,72.75
ATUSB-3V3  (via drill 0.7)
  Top 0.406: C21-ATUSB.1 39.91,27.57 U$1.32 38.77,28.85 | C40-ATUSB.1 41.66,32.52 41.66,31.32 U$1.4 38.77,31.32 38.77,28.85 | 38.77,28.85 34.77,28.85 U$1.27 34.79,26.8 33.39,25.4 C1-UCAP.1 23.22,24.79 21.74,26.26 19.76,26.26 | 18.69,31.27 R2-ATUSB-RST.2 | 18.69,31.27 18.69,41 | 28.5,39.99 29.92,39.99 | 19.76,26.26 19.76,29.13 18.69,30.2 18.69,31.27 | R29-ATUSB-SS.1 28.5,38.43 28.5,39.99 | 29.92,39.99 ATUSB-3V3.TP | UCAP-3V3.1 19.76,26.26 | 18.69,41 25.38,41 25.73,40.64 27.85,40.64 28.5,39.99 | 29.92,39.99 R1-HWB.2 | v19.33,41.88 18.69,41.25 18.69,41
  Bottom 0.406: BSPI-POWER.1 20.62,43.18 v19.33,41.88
ATUSB-RST  (via drill 0.7)
  Top 0.406: BACKUP-ICSP.5 21.77,32.89 | R2-ATUSB-RST.1 21.77,31.24 21.77,32.89 | ATUSB-RST.TP 22.33,41.99 21.11,43.2 17.83,43.2 17.8,28.6 18.34,28.07 v18.47,28.07 | U$1.24 33.4,28.93 33.4,31.52 v34.04,31.52 | v29.69,33.55 27.96,33.55 27.96,32.89 21.77,32.89
  Bottom 0.61: v18.47,28.07 21.77,28.07 BACKUP-ICSP.5 | v34.04,31.52 31.75,31.52 31.75,33.55 v29.69,33.55
ATUSB-SS  (via drill 0.7)
  Top 0.406: R29-ATUSB-SS.2 31.55,38.43 | U$1.14 34.77,36.68 33.02,38.43 31.55,38.43 | IC1.14 63.54,54.37 v63.37,54.2 | 31.55,38.43 v31.55,38.81
  Bottom 0.406: v63.37,54.2 65.02,52.55 68.81,52.55 69.16,52.17 69.16,50.85 68.38,50.06 42.75,50.06
  Bottom 0.61: v31.55,38.81 42.75,50.06
D-PB3  (via drill 0.7)
  Top 0.406: v61.9,62.81 61.9,62.08 60.15,62.08 IC1.7
  Bottom 0.406: BREAKOUT-2.2 59.36,76.33 57.51,74.47 57.51,69.34 59.38,67.46 59.38,65.3 v61.9,62.81
ESCL-1W-T-PC1  (via drill 0.7)
  Top 0.406: v65.28,64.62 65.28,64.21 64.44,63.37 64.47,58.89 IC1.11 60.14,57.61 57.94,57.61 R17-ESCL.1
  Bottom 0.406: BREAKOUT-2.7 72.06,69.85 66.85,64.62 v65.28,64.62
ESDA-1W-T-PC0  (via drill 0.7)
  Top 0.406: v63.04,65.58 63.6,65.58 63.6,59.69 IC1.10 58.17,59.69 58.17,58.4 56.52,58.4 55.88,57.76 55.88,56.2 R18-ESDA.1
  Bottom 0.406: BREAKOUT-2.6 69.52,68.35 66.75,65.58 v63.04,65.58
FSA03-RST  (via drill 0.7)
  Top 0.406: v73.38,60.02 72.91,60.49 IC1.25
  Top 0.61: FSA03-RST.TP 67.49,34.27 v69.83,34.27
  Bottom 0.406: FSA03.RES 88.42,13.12
  Bottom 0.61: 72.07,33.8 64.54,26.26 64.54,10.64 70.31,4.88 77.7,4.88 82.05,9.23 86.62,9.23 87.99,10.6 FSA03.RES | 72.07,33.8 75.23,36.96 84.89,36.96 85.78,37.85 85.78,52.65 78.41,60.02 v73.38,60.02 | v69.83,34.27 71.6,34.27 72.07,33.8
GND  (via drill 0.7, 1.5, 1.6, 3.2)
  Top 0.406: U$1.28 35.57,24.79 C1-UCAP.2 | C40-ATUSB.2 42.9,30.52 U$1.3 | C21-ATUSB.2 38.2,24.77 | C11-XM.2 57.54,61.29 IC1.8 57.58,61.29 56.77,62.1 v55.55,62.1 | 65.77,72.87 65.84,72.82 66.7,72.82 67.17,72.35 C10-XM-AVCC.2 66.74,71.43 IC1.38 66.74,67.32 67.64,66.42 | 65.77,72.87 65.44,73.11 C5.2 65.44,74.65 62.41,74.65 C39-XM-AVCC.- | v78.23,63.84 C10-XM.2 73.93,64.49 IC1.30 69.57,64.49 67.64,66.42 | U$2.18 | v78.23,69.47 C4.2 | IC1.18 66.74,52.92 C12-XM.2 68,51.97 v67.54,51.51 | v66.31,62.99 66.31,65.09 67.64,66.42 | X1.GND 38.38,9.77 38.38,10.64 39.03,11.29 C10-VBUS.2 | 65.77,72.87 65.82,72.82 68.53,72.82 v68.53,73.15
  Top 0.61: C10-VBUS.2 42.39,11.29 42.39,10.29 | v43.97,6.78 42.39,8.36 42.39,10.29 | 42.82,26.19 C2.2 | 42.9,30.52 45.44,30.52 45.44,34.01 | 45.44,34.01 52.25,34.01 52.25,26.19 | 42.82,26.19 C3.2 | 52.25,26.19 42.82,26.19 | 52.25,26.19 52.25,16.46 46,16.46 | C21-ATUSB.2 38.22,22.12 44.32,22.12 44.32,16.46 46,16.46 | 42.39,10.29 C39-VBUS.- 44.07,10.36 46,10.36 46,16.46 | C1-UCAP.2 35.12,21.8 32.83,21.8 30.96,19.94 22.76,19.94 v20.34,17.52 | GND-1.TP 45.44,38.86 45.44,34.01 | C39-FSA03.- 67.11,28.93 SJ2.2 GND-2.TP | GND-3.TP 28.02,43.76 v28.63,43.76 | C20-AREF.- 49.78,78.23 51.36,76.66 C39-NIM2.-
  Top 1.016: 8.38,45.19 8.38,48.78 C22-REGOUT.2 10.03,48.71 IC3.1 13.35,49.87 22.15,49.87 C20-REGOUT.- 40.08,49.78 40.08,53.9 | 8.38,45.19 C39-VIN.- 8.38,34.72 POWER.2 | C21-VIN.2 10.03,45.19 8.38,45.19 | v15.19,33.76 15.24,14.43 20.34,14.43 v20.34,17.52 v20.34,17.53 | U$2.18 C10-NIM2.2 50.18,74.23 C39-NIM2.- | BREAKOUT-2.11 BREAKOUT-2.10 87.76,78.33 87.76,34.59 76.45,34.59 v70.38,28.55 67.11,25.27 C39-FSA03.- | v43.97,6.78 67.26,6.81 v71.07,10.64 | 40.08,53.9 U$2.10 | U$2.18 40.08,74.22 40.08,53.9
  Bottom 0.406: X3.SW3 | 10.19,21.21 16.99,21.21 16.99,20.98 23.22,20.98 | v78.23,63.84 v78.23,69.47 | 50.42,51.18 54.1,51.18 54.1,56.74 59.02,56.74 | 59.02,56.74 65.28,62.99 66.26,62.99 v66.31,62.99 | 59.02,56.74 64.25,51.51 v67.54,51.51 | v55.55,62.1 54.2,62.1 54.2,58.62 50.42,58.62 50.42,51.18 | 50.42,51.18 45.09,51.18 45.09,51.92 43.66,51.92 | ESD-PROT.1 37.54,13.79 40.69,13.79 42.11,13.81 42.14,8.37 | C22-AREF.2 68.53,71.83 v68.53,73.15
  Bottom 0.61: BACKUP-ICSP.6 23.22,33.02 23.22,20.98 | 10.19,21.21 10.19,17.52 X3.3 | v28.63,43.76 33.53,43.76 41.66,51.92 43.66,51.92 U$2.10
  Bottom 1.016: X3.6 26.82,10.02 | 29.41,2.13 X3.SW3 | 26.82,10.02 26.82,4.72 29.41,2.13 | 29.41,2.13 32.36,2.13 35.64,5.41 35.64,8.37 42.14,8.37 42.38,8.37 v43.97,6.78 | X3.3 v20.34,17.52 26.82,17.52 26.82,10.02 | 71.07,15.8 70.51,15.8 C10-FSA03-2.2 66.78,15.81 66.78,25.31 C10-FSA03-1.2 | 71.07,15.8 FSA03.GND1 | v15.19,33.76 15.19,34.72 POWER.2 | FSA03.GND2 72.16,25.31 C10-FSA03-1.2 | C10-FSA03-1.2 v70.38,28.55 | v71.07,10.64 71.07,15.8 | v66.31,62.99
  other vias: 17.78,74.93 21.59,74.93 25.4,74.93 29.21,74.93 33.02,74.93 36.83,74.93 12.7,53.34 16.51,53.34 20.32,53.34 24.13,53.34 27.94,53.34 31.75,53.34 35.56,53.34 17.78,71.12 21.59,71.12 25.4,71.12 29.21,71.12 33.02,71.12 36.83,71.12 2.54,81.28 15.88,81.92 28.57,81.92 38.73,81.92 53.98,81.92 66.67,81.92 79.38,81.92 86.72,67.94 2.54,65.41 1.91,53.98 1.91,41.27 1.75,26.7 12.7,1.91 5.71,5.08 1.91,15.88 1.91,5.08 88.27,8.26 79.38,1.91 73.03,1.91 60.33,1.91 47.62,1.91 34.92,1.91 22.23,1.91 2.54,78.11 13.51,77.98 28.57,77.47 38.73,77.47 48.34,11.43 56.77,29.72 62.59,11.51 24.77,13.97 18.41,12.06 17.78,5.71 24.77,5.71 8.89,10.16 4.45,22.86 75.18,30.48 5.79,30.15 1.7,36.42 46.51,32.79 58.8,22.35 82.93,30.23 82.93,7.37 41.53,21.08 46.35,22.35 42.04,14.99 30.35,16.38 24.77,23.62 9.65,50.42 15.11,44.45 6.93,42.06 37.24,48.06 83.11,63.91 11.3,56.36 15.32,56.44 19.13,56.44 22.94,56.44 26.85,57.63 30.56,56.44 34.37,56.44 38.18,56.44 12.78,59.99 16.59,59.99 20.4,59.99 23.37,59.56 27.18,61.04 30.68,58.85 35.64,59.99 20.32,67.61 17.04,63.7 22.33,63.88 27.33,65.43 32.31,62.74 34.37,64.14 38.18,64.14 11.51,64.06 14.68,65.94 17.5,68.5 24.16,67.08 27.28,68.4 30.38,67.18 34.67,67.84 38.48,67.84 38.4,60.05 38.33,53.31 38.68,71.12 48.9,76.45 6.35,54.61 44.45,80.01 85.09,3.81 77.44,33.17
  pour Top (isolate 0.61): 86.36,1.27 arc90 88.9,3.81 88.9,8.89 arc90 86.36,11.43 73.79,11.43 arc-90 71.25,13.97 71.25,26.67 arc-90 73.79,29.21 86.36,29.21 arc90 88.9,31.75 88.9,80.01 arc90 86.36,82.55 3.81,82.55 arc90 1.27,80.01 1.27,79.38 arc90 3.81,76.83 13.97,76.83 arc-90 16.51,74.3 16.51,69.22 arc-90 13.97,66.67 3.81,66.67 arc90 1.27,64.14 1.27,3.81 arc90 3.81,1.27
  pour Bottom (isolate 0.61): 86.36,1.27 arc90 88.9,3.81 88.9,8.89 arc90 86.36,11.43 73.79,11.43 arc-90 71.25,13.97 71.25,26.67 arc-90 73.79,29.21 86.36,29.21 arc90 88.9,31.75 88.9,80.01 arc90 86.36,82.55 3.81,82.55 arc90 1.27,80.01 1.27,79.38 arc90 3.81,76.83 13.97,76.83 arc-90 16.51,74.3 16.51,69.22 arc-90 13.97,66.67 3.81,66.67 arc90 1.27,64.14 1.27,3.81 arc90 3.81,1.27
HWB
  Top 0.406: HWB.TP 39.5,38.28 35.61,38.28 R1-HWB.1 35.57,38.29 U$1.13
LED-GND  (via drill 0.7)
  Top 0.406: LED4.C 58.44,70.8 LED7.C | LED6.C 70.1,48.82 68.25,48.82 v68.25,39.37 | v30.99,26.16 30.48,25.65 24.23,25.65 23.46,26.43 LED5.C
  Top 0.61: 77.14,75.67 BREAKOUT-2.9 | 77.14,75.67 v64.14,75.67 | LED4.C 58.42,71.83 v59.05,72.47 | 62.97,27.48 62.97,34.09 v68.25,39.37 69.04,38.58 83.69,38.58 85.29,40.18 85.29,71.25 86.11,72.06 86.11,74.68 85.11,75.67 77.14,75.67 | 62.97,27.48 SJ2.1 LED-GND.TP | 62.97,27.48 LED2.C
  Top 0.813: LED5.C LED3.C LED1.C
  Bottom 0.406: v64.14,75.67 60.94,72.47 v59.05,72.47 | 43.03,38.2 43.03,39.4 v68.25,39.37
  Bottom 0.61: v30.99,26.16 43.03,38.2
MISO  (via drill 0.7)
  Top 0.406: BACKUP-ICSP.1 21.77,39.17 23.04,37.9 23.04,36.12 23.77,35.38 28.7,35.38 29.56,34.52 U$1.17 33.5,34.52 v33.5,34.14 | BREAKOUT-1.2 59.36,46.58 65.14,52.36 IC1.16
  Bottom 0.406: 59.36,41.12 58.62,40.39 39.01,40.39 33.5,34.87 v33.5,34.14
  Bottom 0.61: BACKUP-ICSP.1 17.5,39.19 17.5,32.61 12.52,27.64 11.05,27.64 10.52,27.1 10.52,25.65 5.99,25.65 5.99,7.52 X3.7 | 59.36,41.12 BREAKOUT-1.2
MOSI
  Top 0.406: U$1.16 29.73,35.88 28.96,36.65 BACKUP-ICSP.4 | BREAKOUT-1.1 56.82,45.31 64.34,52.83 IC1.15
  Bottom 0.406: X3.2 27.69,20.02 | BREAKOUT-1.1 40.06,42.77 U$1.16 27.85,35.88 27.69,35.71
  Bottom 0.61: BACKUP-ICSP.4 27.69,36.65 27.69,35.71 27.69,20.02
N$1
  Top 0.406: U$1.22 30.35,30.52 30.35,31.34 R10-ATUSB-LED.2
N$2  (via drill 0.7)
  Top 0.406: 44.07,13.31 C39-VBUS.+ | 40.64,13.31 40.64,13.02 C10-VBUS.1
  Top 0.61: FB-USB.1 31.29,15.11 v33.12,15.11 | 40.64,13.31 44.07,13.31 | C10-VBUS.1 38.73,14.92 v38.73,15.11 39.73,16.1 41.02,16.1 41.76,16.84 ENABLE-VBUS.1
  Bottom 0.61: v33.12,15.11 34.44,15.11 | 34.44,15.11 v38.73,15.11 | ESD-PROT.4 34.51,15.04 34.44,15.11
N$3
  Top 0.406: R3-USB.2 34.42,17.93 37.17,17.93 U$1.30
N$4  (via drill 0.7)
  Top 0.406: R4-USB.2 37.19,16.61 v35.69,16.61 | v35.69,19.36 36.37,19.36 U$1.29
  Bottom 0.61: v35.69,16.61 v35.69,19.36
N$5
  Top 0.406: U$1.1 41.27,28.93 41.27,23.59 C3.1
  Top 0.61: C3.1 48.72,23.59 Q1-ATUSB.2
N$6
  Top 0.406: C2.1 42.82,29.73 U$1.2
  Top 0.61: Q1-ATUSB.1 48.69,28.82 C2.1
N$7
  Top 1.016: D1.C 11.98,36.57 C39-VIN.+ 12.19,40.28 12.19,43.48 | 12.19,43.48 IC3.3 | C21-VIN.1 10.03,43.48 12.19,43.48
N$8
  Bottom 1.27: X2.1 13.18,71.63 U$2.2
N$9  (via drill 0.7)
  Top 0.406: X1.D- 35.01,11.29 R3-USB.1 33.77,11.29 v32.89,12.17
  Bottom 0.406: v32.89,12.17 33.79,11.27 ESD-PROT.3
N$10  (via drill 0.7)
  Top 0.406: X1.D+ 35.81,11.29 R4-USB.1 37.66,11.29 v38.76,12.39
  Bottom 0.406: v38.76,12.39 37.63,11.27 ESD-PROT.2
N$11
  Top 0.406: LED1.A 25.56,31.34
  Top 0.813: 25.56,31.34 R10-ATUSB-LED.1
N$12  (via drill 0.7)
  Top 0.406: R6-PDI.2 43.75,37.69 42.67,37.69 PDI_DATA.TP 42.67,40.16 46.81,40.16 v46.79,47.47 | IC1.34 70.25,68.38 81.71,68.38 81.71,55.91 82.53,55.09 v82.53,50.8
  Top 0.61: R5-PDI.2 R6-PDI.2
  Bottom 0.61: v82.53,50.8 82.53,47.47 v46.79,47.47
N$13
  Top 0.406: U$1.8 42.05,34.52 R5-PDI.1
N$14
  Top 0.406: U$1.9 42.05,35.88 R6-PDI.1
N$15  (via drill 1)
  other vias: 5.79,34.72
N$16  (via drill 1)
  other vias: 5.79,32.18
N$17
  Top 0.406: IC1.37 67.54,70.31 68.56,71.32 69.52,71.32 69.52,74.19 | 72.47,73.91 Q2-XM.2 72.47,74.19 69.52,74.19 | C5.1 67.14,74.19 69.52,74.19
N$18
  Top 0.406: IC1.36 68.34,69.96 71.79,69.96 C4.1 71.79,70.51 78.74,70.51 81.76,73.53 Q2-XM.1
N$19
  Top 0.406: LED4.A 58.55,68.72 R8.1
N$20  (via drill 0.7)
  Top 0.406: IC1.3 50.65,65.29 v50.65,64.85
  Top 0.61: U$2.12 50.65,58.98 v50.65,60.38
  Bottom 0.61: v50.65,60.38 v50.65,64.85
N$21
  Bottom 1.016: BREAKOUT-2.1 55.09,76.61 FB-BREAKOUT.2
N$22  (via drill 0.7)
  Top 0.406: v70.13,65.46 70.64,66.09 IC1.32
  Bottom 0.406: 78.31,62.1 77.11,63.3 77.11,66.06 70.74,66.06 v70.13,65.46
  Bottom 0.61: R14.1 86.26,35.13 87.12,35.99 87.12,59.74 84.78,62.08 78.31,62.1
N$23  (via drill 0.7)
  Top 0.406: v79.53,66.45 79.52,66.89 IC1.33
  Bottom 0.61: R13.1 88.32,61.01 82.88,66.45 v79.53,66.45
N$24  (via drill 0.7)
  Top 0.406: IC1.1 56.27,66.89 v56.01,67.16
  Top 0.61: 47.07,68.54 44.26,68.54 U$2.16 | 47.07,68.54 R11.1 | 47.07,68.54 v47.07,67.18
  Bottom 0.406: v56.01,67.16 56.01,68.4 54.43,69.98 47.04,69.98 v47.07,67.18
N$25
  Top 0.406: R9.1 49.45,67.69 48.36,66.6 | IC1.2 52.98,66.09 52.48,66.6 48.36,66.6 | U$2.15 45.62,66.6 46.35,65.86 47.62,65.86 48.36,66.6
N$26  (via drill 0.7)
  Top 0.406: v58.5,62.48 58.5,62.89 IC1.6
  Top 0.61: U$2.14 45.72,64.06 46.35,63.42 v52.22,63.42
  Bottom 0.61: v52.22,63.42 58.5,63.42 v58.5,62.48
N$27
  Top 0.406: IC1.4 53.72,64.49 53.72,61.52 U$2.13
N$28
  Top 0.406: 53.06,56.44 53.06,60.43 54.51,60.43 54.51,63.69 IC1.5
  Top 0.61: U$2.11 53.06,56.44
N$29
  Bottom 0.61: R13.2 88.34,28.04 FSA03.RX
N$30
  Top 0.61: LED2.A R12.1
N$31  (via drill 0.7)
  Top 0.406: U$1.11 37.17,37.13 41.05,37.13 PDI_CLK.TP 41.02,41.77 | 41.02,41.77 R7-XM-RST.1 | 41.02,41.77 45.67,41.77 v45.7,49 | v80.87,51.56 80.87,67.61 70.76,67.61 70.1,66.95 69.93,66.95 69.14,67.74 IC1.35
  Bottom 0.61: v45.7,49 80.87,49 v80.87,51.56
N$32  (via drill 0.7)
  Top 0.61: v66.98,13.99 62.97,18.01 R12.2
  Bottom 0.61: FSA03.TM 78.97,9.2 76.5,6.73 70.64,6.73 66.98,10.36 v66.98,13.99
N$33
  Top 0.406: LED6.A 70.08,51.52
  Top 0.61: 70.08,51.52 R21.1
N$34
  Bottom 1.016: D2.C 53.43,74.43 FB-BREAKOUT.1
N$35
  Top 0.406: R8.2 61.92,68.67 IC1.44
N$36
  Bottom 0.61: FSA03.TX 84.97,30.75 R14.2
N$37
  Top 0.406: U$1.23 30.35,29.73 30.35,29.41 29.02,29.41 R19-ATUSB-LED.2
N$38
  Top 0.406: 27.32,29.23 R19-ATUSB-LED.1
  Top 0.813: LED3.A 27.32,29.23
N$39
  Top 0.406: U$1.25 29.02,27.57 R20-ATUSB-LED.2
N$40
  Top 0.813: LED5.A R20-ATUSB-LED.1
N$41
  Top 0.406: IC1.21 69.14,55.56 R21.2
N$42
  Top 0.406: IC1.12 61.94,56.56 R22.1
N$43
  Top 0.406: IC1.13 62.74,55.31 R23.1
N$44
  Top 0.406: IC1.22 69.94,56.12 70.36,55.7 73.11,55.7 R24.1
N$45
  Top 0.406: R25.1 73.5,58.89 IC1.23
N$46
  Top 0.406: R26.1 74.83,60.43 74.17,61.09 73.43,61.09 73.23,61.29 IC1.26
N$47
  Top 0.406: R27.1 74.21,62.09 IC1.27
N$48
  Top 0.406: X1.VBUS 33.22,9.79 33.22,10.21 32.07,11.37 FB-USB.2
N$49
  Top 0.406: 47.32,71.68 C10-NIM2.1 47.32,72.57 | 51.23,71.68 C39-NIM2.+ | R11.2 47.32,70.24
  Top 1.016: U$2.17 47.32,71.68 49.43,71.68 | 49.43,71.68 51.23,71.68 | 47.32,70.24 C10-NIM2.1 | C39-NIM2.+ FB-NIM2.1 | R9.2 49.43,70.27 49.43,71.68
N$50  (via drill 1.6)
  Top 1.016: C39-FSA03.+ 67.11,18.45 FB-FSA03.2 70.21,20.55 v69.83,20.55
  Bottom 1.016: 70.38,20.52 FSA03.VCC | 70.38,20.52 C10-FSA03-1.1 | C10-FSA03-2.1 70.38,20.52 | 70.38,20.52 v69.83,20.55
N$51
  Top 0.406: IC1.39 65.94,71.39 C10-XM-AVCC.1 65.47,71.63 C39-XM-AVCC.+ 60.35,71.63 60.35,75.37 FB-XM-AVCC.1 59.16,75.44
N$52
  Top 0.61: LED7.A 54.1,70.85 54.1,75.47 R30.1
N$53
  Top 1.016: POWER.1 12.01,32.18 D1.A
N$54  (via drill 1)
  other vias: 3.25,32.18
N$55  (via drill 1)
  other vias: 3.25,34.72
N$56  (via drill 0.7)
  Top 0.406: v38.76,26.29 37.97,26.29 U$1.31
  Top 0.61: ENABLE-VBUS.2 38.76,19.53 v38.76,20.6 | UVCC-3V3.1 22.73,15.04 25.73,18.03 v31.7,18.03
  Bottom 0.61: 38.76,21.46 v38.76,20.6 | 38.76,21.46 v38.76,26.29 | v31.7,18.03 35.13,21.46 38.76,21.46
RF_GND
  Top 1.27: U$2.1 8.61,74.22 | 8.61,74.22 3.52,74.22 X2.4 | U$2.3 8.59,69.14 | 8.59,69.14 3.53,69.14 | 3.53,69.14 3.53,69.06 | 3.53,69.14 3.53,74.17 | X2.5 8.61,74.22 | X2.2 8.59,69.08 8.59,69.14
  Bottom 1.27: U$2.1 3.52,74.22 X2.3 3.52,69.14 U$2.3
RXDC0
  Top 0.406: BREAKOUT-1.4 64.44,40.62 63.25,39.42 55.4,39.42 53.29,41.53 53.29,46.22 R22.2
RXDD0
  Top 0.406: R24.2 74.7,52.92 74.7,50.16 69.52,45.01 BREAKOUT-1.6
RXDD1
  Top 0.406: BREAKOUT-1.8 74.57,46.02 76.33,47.78 76.35,60.1 R26.2
SCK  (via drill 0.7)
  Top 0.406: v31.88,36.98 33.48,36.98 33.97,36.49 U$1.15 | IC1.17 65.94,51.87 61.9,47.83 BREAKOUT-1.3
  Bottom 0.406: 7.75,23.77 18.69,23.77 | BACKUP-ICSP.3 23.04,37.92 29.26,37.92 30.2,36.98 v31.88,36.98
  Bottom 0.61: X3.5 7.75,12.52 7.75,23.77 | 18.69,23.77 18.69,24.87 16.41,27.15 16.41,29.08 18.69,31.37 18.69,36.65 BACKUP-ICSP.3 | BREAKOUT-1.3 61.9,44.07 60.73,45.24 40.16,45.24 v31.88,36.98
SCL  (via drill 0.7)
  Top 0.406: BREAKOUT-1.10 79.68,47.42 | 79.68,47.42 78.56,47.42 v78.56,54.3 | v69.34,61.75 69.6,61.75 69.6,63.7 71.74,63.7 IC1.29 | R16-SCL.1 80.91,47.42 79.68,47.42
  Bottom 0.406: v78.56,54.3 68.61,54.3 68.63,61.75 v69.34,61.75
SDA  (via drill 0.7)
  Top 0.406: v66.34,60.78 70.38,60.78 70.38,62.89 IC1.28 | R15-SDA.1 83.7,47.37 82.22,47.37 BREAKOUT-1.11
  Bottom 0.406: v66.34,60.78 66.37,53.26 82.19,53.26 83.57,51.89 83.57,44.12 BREAKOUT-1.11
SDCARD-DET  (via drill 0.7)
  Top 0.406: v69.77,58.85 70.61,59.69 IC1.24
  Bottom 0.406: v69.77,58.85 70.64,57.99 70.64,56.54 71.86,55.32 81.41,55.32 84.53,52.17 84.53,40.46 69.88,40.46
  Bottom 0.61: X3.SW1 29.78,3.92 28.55,5.16 28.55,18.59 45.97,36.02 69.88,36.02 69.88,40.46
SDCARD-SS  (via drill 0.7)
  Top 0.406: IC1.43 62.74,67.18 61.87,66.32 61.87,64.39 v62.15,64.14 | 22.07,23.7 R28-SDCARD-SS.2 | v55.22,38.2 51.94,41.48 v51.94,52.43
  Top 0.61: v18.64,22.02 22.07,22.02 | 22.07,22.02 v28.85,22.02 | 22.07,22.02 22.07,23.7
  Bottom 0.406: v62.15,64.14 63.09,63.17 63.09,62.33 58.37,57.63 51.94,57.66 v51.94,52.43 | v18.64,22.02 18.65,22.52 X3.1
  Bottom 0.61: v55.22,38.2 45.09,38.2 v28.85,22.02
SPI-VCC
  Bottom 1.016: BSPI-POWER.2 23.65,39.85 BACKUP-ICSP.2
T-PD0  (via drill 0.7)
  Top 0.406: IC1.20 68.34,59.78 65.29,59.78 65.29,61.78 67.94,61.78 v67.94,64.03
  Bottom 0.406: 74.6,71.32 67.94,64.67 v67.94,64.03
  Bottom 0.61: 74.6,71.32 BREAKOUT-2.8
TXDC0
  Top 0.406: R23.2 61.96,52.92 54.71,45.67 54.71,41.6 55.88,40.44 62.38,40.44 63.17,41.22 63.17,44.55 64.21,45.59 65.68,45.59 66.98,44.3 BREAKOUT-1.5
TXDD0
  Top 0.406: BREAKOUT-1.7 72.06,45.44 75.51,48.87 75.51,58.04 R25.2
TXDD1
  Top 0.406: BREAKOUT-1.9 77.44,42.77 77.44,62.15 R27.2

### Text on the board
tPlace: PWR | XM1 | XM2 | - | + | ATUSB | GPS | ALIEN-2 Flight Computer | Daniel Richman 2010 | CC-BY-NC-SA 2.0 UK
Document: ALIEN2 Flight Computer - Daniel Richman, 2010. | This work is licensed under the Creative Commons Attribution-Non-Commercial-Share Alike 2.0 UK: England & Wales Licence. | http://creativecommons.org/licenses/by-nc-sa/2.0/uk/